# EAGLE design SparkFun_Digi_XBee_Explorer_USB-C (EAGLE 9.6.2)
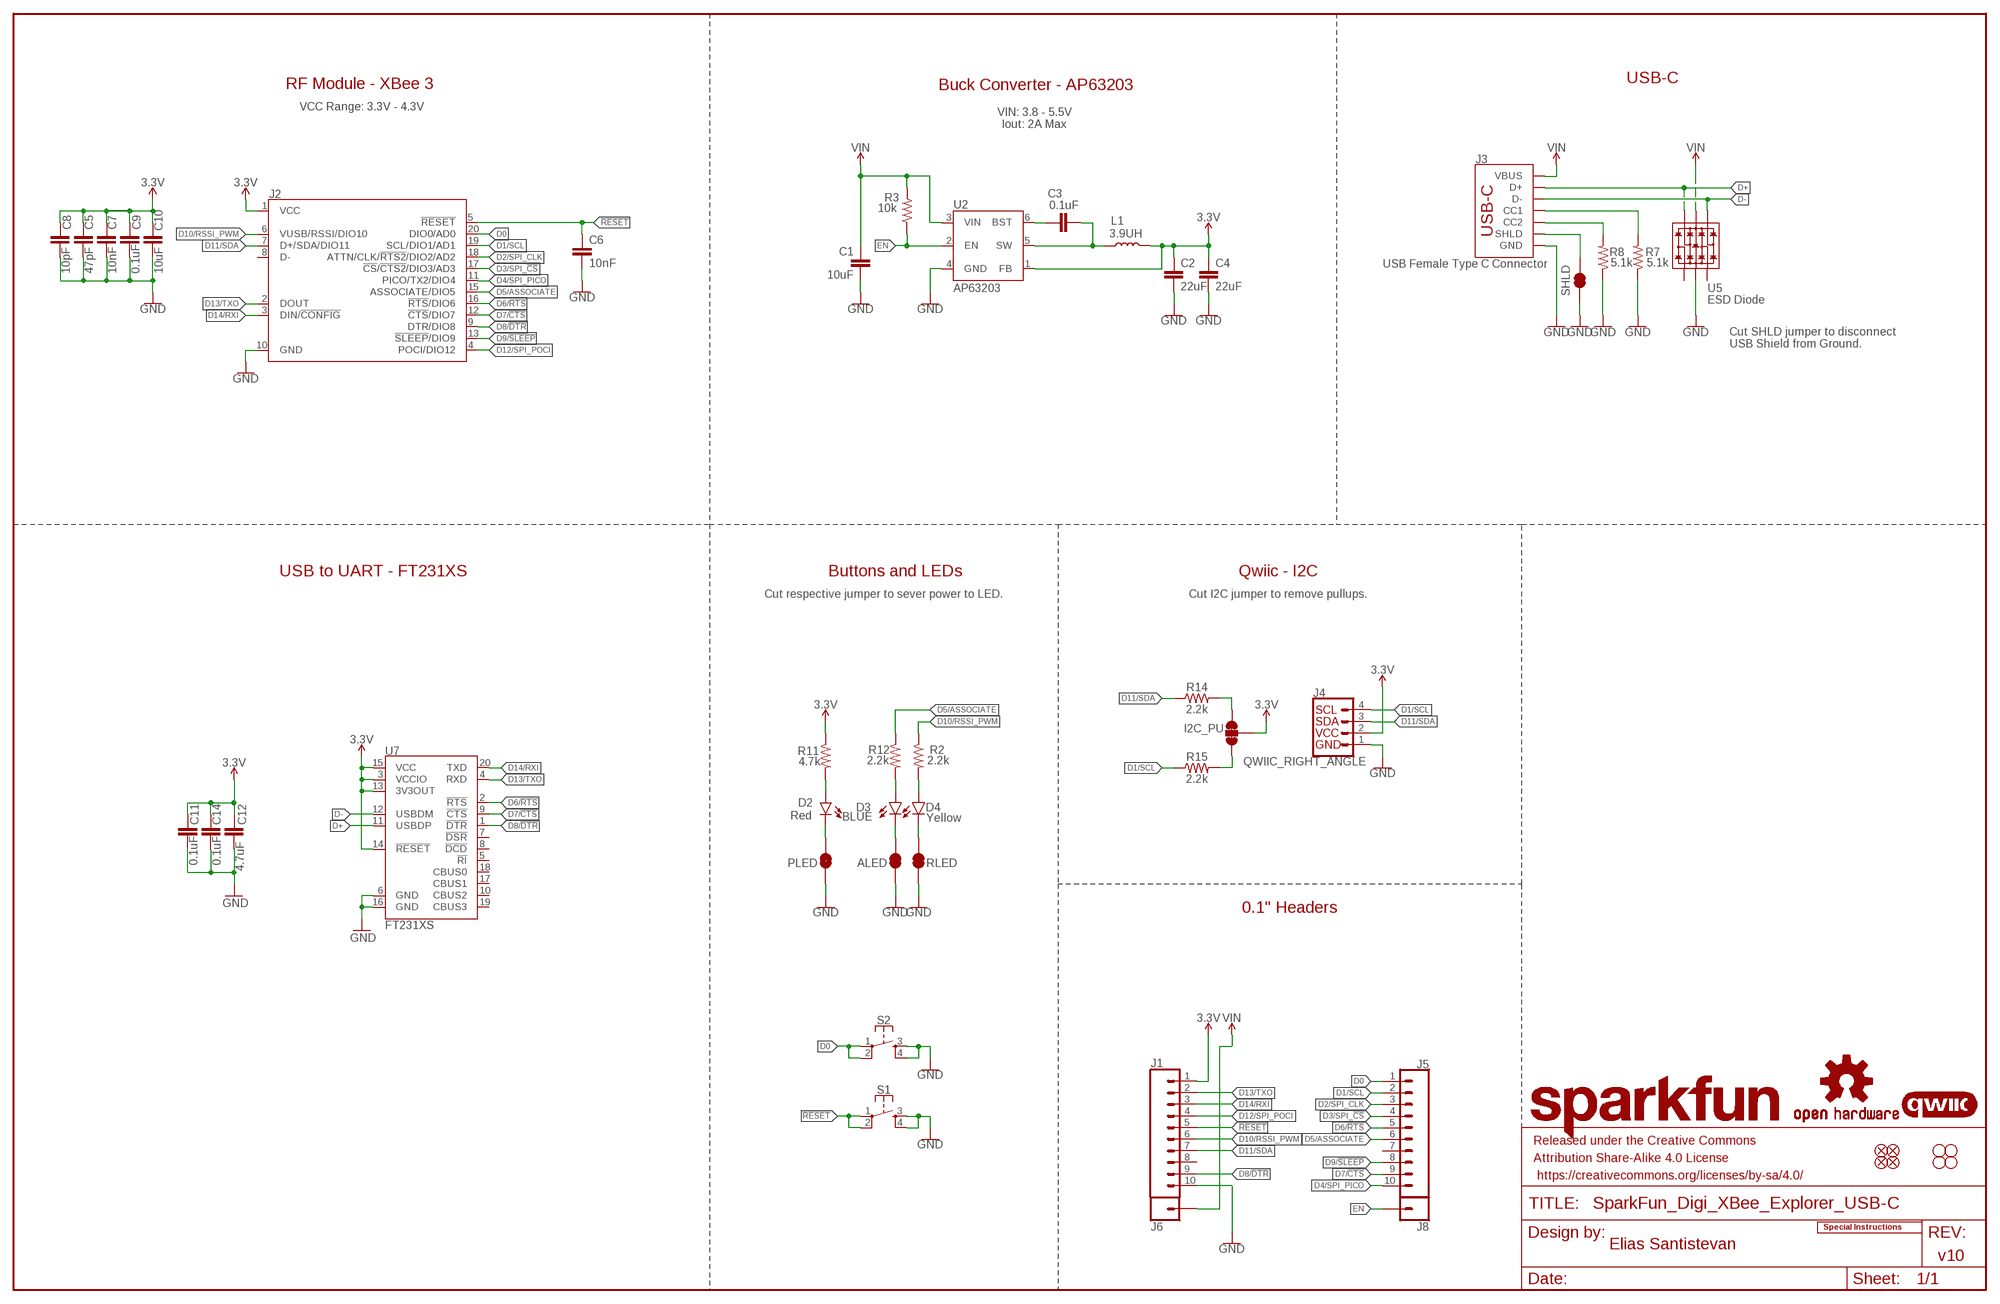
[diagram p0: schematic, sheet 1]

## Parts
ALED  JUMPER-SMT_2_NC_TRACE_SILK  [SMT-JUMPER_2_NC_TRACE_SILK]
C1  10uF  10UF-1210-50V-20%  [1210]
C2  22uF  22UF-0603-6.3V-20%  [0603]
C3  0.1uF  0.1UF-0603-25V-5%  [0603]
C4  22uF  22UF-0603-6.3V-20%  [0603]
C5  47pF  47PF-0603-50V-5%  [0603]
C6  10nF  10NF-0603-50V-10%  [0603]
C7  10nF  10NF-0603-50V-10%  [0603]
C8  10pF  10PF-0603-50V-5%  [0603]
C9  0.1uF  0.1UF-0603-25V-(+80/-20%)  [0603]
C10  10uF  10UF-0603-6.3V-20%  [0603]
C11  0.1uF  0.1UF-0603-25V-(+80/-20%)  [0603]
C12  4.7uF  4.7UF-0603-6.3V-(10%)  [0603]
C14  0.1uF  0.1UF-0603-25V-(+80/-20%)  [0603]
D2  Red  LED-RED_0603-KB  [LED-0603]
D3  BLUE  LED-BLUE0603  [LED-0603]
D4  Yellow  LED-YELLOW0603  [LED-0603]
FD1  FIDUCIAL1X2  [FIDUCIAL-1X2]
FD2  FIDUCIAL1X2  [FIDUCIAL-1X2]
FD3  FIDUCIAL1X2  [FIDUCIAL-1X2]
FD4  FIDUCIAL1X2  [FIDUCIAL-1X2]
FRAME1  FRAME-LEDGER  [CREATIVE_COMMONS]
H1  STAND-OFFTIGHT  [STAND-OFF-TIGHT]
H2  STAND-OFFTIGHT  [STAND-OFF-TIGHT]
H3  STAND-OFFTIGHT  [STAND-OFF-TIGHT]
H4  STAND-OFFTIGHT  [STAND-OFF-TIGHT]
I2C_PU  JUMPER-SMT_3_2-NC_TRACE_SILK  [SMT-JUMPER_3_2-NC_TRACE_SILK]
J1  CONN_01PTH_NO_SILK_STAND  [1X01_NO_SILK_STAND]
J2  XBEE_UPDATEXBEE_SMD  [XBEE3-SMD]
J3  USB Female Type C Connector  USB_C_4-LAYER-ISOLATED  [USB-C-16P-4LAYER-ISOLATED]
J4  QWIIC_RIGHT_ANGLE  QWIIC_CONNECTORJS-1MM  [JST04_1MM_RA]
J5  CONN_10NO_SILK_PTH_FEMALE  [1X10_NO_SILK]
J6  CONN_10NO_SILK_PTH_FEMALE  [1X10_NO_SILK]
J8  CONN_01PTH_NO_SILK_STAND  [1X01_NO_SILK_STAND]
L1  3.9UH  [INDUCTOR_3.9UH]
LOGO1  SFE_LOGO_NAME.2_INCH  [SFE_LOGO_NAME_.2]
LOGO2  OSHW-LOGOS  [OSHW-LOGO-S]
LOGO3  QWIIC_LOGO_4MM  [QWIIC_4MM]
LOGO4  SPECIAL_INSTRUCTIONS-ORDERING  [ORDERING_INSTRUCTIONS]
PLED  JUMPER-SMT_2_NC_TRACE_SILK  [SMT-JUMPER_2_NC_TRACE_SILK]
R2  2.2k  2.2KOHM-0603-1/10W-1%  [0603]
R3  10k  10KOHM-0603-1/10W-1%  [0603]
R7  5.1k  5.1KOHM5.1KOHM-0603-1/10W-1%  [0603]
R8  5.1k  5.1KOHM5.1KOHM-0603-1/10W-1%  [0603]
R11  4.7k  4.7KOHM-0603-1/10W-1%  [0603]
R12  2.2k  2.2KOHM-0603-1/10W-1%  [0603]
R14  2.2k  2.2KOHM-0603-1/10W-1%  [0603]
R15  2.2k  2.2KOHM-0603-1/10W-1%  [0603]
RLED  JUMPER-SMT_2_NC_TRACE_SILK  [SMT-JUMPER_2_NC_TRACE_SILK]
S1  MOMENTARY-SWITCH-SPST-2-SMD-5.2MM-TALL  [TACTILE_SWITCH_SMD_5.2MM]
S2  MOMENTARY-SWITCH-SPST-2-SMD-5.2MM-TALL  [TACTILE_SWITCH_SMD_5.2MM]
SHLD  JUMPER-SMT_2_NC_TRACE_SILK  [SMT-JUMPER_2_NC_TRACE_SILK]
U2  AP63203  [SOT23-6]
U5  ESD Diode  TVS_DIODE_ARRAY_DT1042-04SO-7  [SOT-23-6]
U7  FT231XS  [SSOP20_L]

## Nets
3.3V: C2.1 C4.1 C5.1 C7.1 C8.1 C9.1 C10.1 C11.1 C12.1 C14.1 I2C_PU.2 J2.1(VCC) J4.2 J6.1 L1.P$2 R11.1 U2.1(FB) U7.3(VCCIO) U7.13(3V3OUT) U7.14(!RESET) U7.15(VCC)
!RESET!: C6.1 J2.5(!RESET!) J6.5 S1.1 S1.2
D0: J2.20(DIO0/AD0) J5.1 S2.1 S2.2
D1/SCL: J2.19(SCL/DIO1/AD1) J4.4 J5.2 R15.1
D2/SPI_CLK: J2.18(ATTN/CLK/!RTS2!/DIO2/AD2) J5.3
D3/SPI_!CS!: J2.17(!CS!/!CTS2!/DIO3/AD3) J5.4
D4/SPI_PICO: J2.11(PICO/TX2/DIO4) J5.10
D5/ASSOCIATE: J2.15(ASSOCIATE/DIO5) J5.6 R12.1
D6/!RTS!: J2.16(!RTS!/DIO6) J5.5 U7.2(!RTS)
D7/!CTS!: J2.12(!CTS!/DIO7) J5.9 U7.9(!CTS)
D8/!DTR!: J2.9(DTR/DIO8) J6.9 U7.1(!DTR)
D9/!SLEEP!: J2.13(!SLEEP!/DIO9) J5.8
D10/RSSI_PWM: J2.6(VUSB/RSSI/DIO10) J6.6 R2.1
D11/SDA: J2.7(D+/SDA/DIO11) J4.3 J6.7 R14.1
D12/SPI_POCI: J2.4(POCI/DIO12) J6.4
D13/TXO: J2.2(DOUT) J6.2 U7.4(RXD)
D14/RXI: J2.3(DIN/!CONFIG!) J6.3 U7.20(TXD)
D+ [Diff pairs]: J3.A6(D+) J3.B6(D+) U5.6(IO4) U7.11(USBDP)
D- [Diff pairs]: J3.A7(D-) J3.B7(D-) U5.4(IO3) U7.12(USBDM)
EN: J8.1 R3.1 U2.2(EN)
GND: ALED.1 C1.2 C2.2 C4.2 C5.2 C6.2 C7.2 C8.2 C9.2 C10.2 C11.2 C12.2 C14.2 J2.10(GND) J3.GND J3.GND2(GND) J4.1 J6.10 PLED.1 R7.1 R8.1 RLED.1 S1.3 S1.4 S2.3 S2.4 SHLD.1 U2.4(GND) U5.2(VSS) U7.6(GND) U7.16(GND)
N$1: C3.1 U2.6(BST)
N$2: D4.A R2.2
N$3: D4.C RLED.2
N$5: J3.B5(CC2) R8.2
N$6: J3.A5(CC1) R7.2
N$7: D2.A R11.2
N$8: C3.2 L1.P$1 U2.5(SW)
N$11: I2C_PU.3 R14.2
N$12: D3.A R12.2
N$13: I2C_PU.1 R15.2
N$21: ALED.2 D3.C
N$23: D2.C PLED.2
SHLD: J3.SHLD1(SHLD) J3.SHLD2(SHLD) J3.SHLD3(SHLD) J3.SHLD4(SHLD) J3.SHLD5(SHLD) J3.SHLD6(SHLD) J3.SHLD7(SHLD) J3.SHLD8(SHLD) SHLD.2
VIN: C1.1 J1.1 J3.VBUS1(VBUS) J3.VBUS2(VBUS) R3.2 U2.3(VIN) U5.5(VCC)
Unconnected: J2.8(D-) J5.7 J6.8 U5.1(IO1) U5.3(IO2) U7.5(!RI) U7.7(!DSR) U7.8(!DCD) U7.10(CBUS2) U7.17(CBUS1) U7.18(CBUS0) U7.19(CBUS3)

## Notes on the sheet
- RF Module - XBee 3 | Buck Converter - AP63203 | USB-C
- VCC Range: 3.3V - 4.3V
- VIN: 3.8 - 5.5V
  Iout: 2A Max
- Cut SHLD jumper to disconnect
  USB Shield from Ground.
- USB to UART - FT231XS | Buttons and LEDs | Qwiic - I2C
- Cut respective jumper to sever power to LED. | Cut I2C jumper to remove pullups.
- 0.1" Headers
- Elias Santistevan
- v10

## Library data of the parts
ALED PLED RLED SHLD = SparkFun-Jumpers:JUMPER-SMT_2_NC_TRACE: Normally closed trace jumper This jumper has a trace between two pads so it's normally closed (NC). Use a razor knife to open the connection. For best results follow the IPC guidelines for cutting traces: Cutout at least 0.063 mm (0.005 in). Remove all loose material to clean up the cut area. Seal the cut with an approved epoxy. Reapply solder to reclose the connection.
C1 = SparkFun-Capacitors:10UF: 10.0µF ceramic capacitors A capacitor is a passive two-terminal electrical component used to store electrical energy temporarily in an electric field.; PROD_ID: CAP-09824
C2 C4 = SparkFun-Capacitors:22UF: 22µF ceramic capacitors A capacitor is a passive two-terminal electrical component used to store electrical energy temporarily in an electric field.; PROD_ID: CAP-14464
C3 = SparkFun-Capacitors:0.1UF: 0.1µF ceramic capacitors A capacitor is a passive two-terminal electrical component used to store electrical energy temporarily in an electric field.; PROD_ID: CAP-08604
C5 = SparkFun-Capacitors:47PF: 47pF ceramic capacitors A capacitor is a passive two-terminal electrical component used to store electrical energy temporarily in an electric field.; PROD_ID: CAP-08913
C6 C7 = SparkFun-Capacitors:10NF: 0.01uF/10nF/10,000pF ceramic capacitors A capacitor is a passive two-terminal electrical component used to store electrical energy temporarily in an electric field. CAP-09321; PROD_ID: CAP-00867
C8 = SparkFun-Capacitors:10PF: 10pF ceramic capacitors A capacitor is a passive two-terminal electrical component used to store electrical energy temporarily in an electric field.; PROD_ID: CAP-11812
C9 C11 C14 = SparkFun-Capacitors:0.1UF: 0.1µF ceramic capacitors A capacitor is a passive two-terminal electrical component used to store electrical energy temporarily in an electric field.; PROD_ID: CAP-00810
C10 = SparkFun-Capacitors:10UF: 10.0µF ceramic capacitors A capacitor is a passive two-terminal electrical component used to store electrical energy temporarily in an electric field.; PROD_ID: CAP-11015
C12 = SparkFun-Capacitors:4.7UF: 4.7µF ceramic capacitors A capacitor is a passive two-terminal electrical component used to store electrical energy temporarily in an electric field.; PROD_ID: CAP-08280
D2 = SparkFun-LED:LED-RED: Red SMD LED Used in manufacturing of most products at SparkFun Packages: 0603 - KB - KingBright (DIO-17976) SMD 0603 package [Datasheet] <https://www.kingbrightusa.com/images/catalog/SPEC/APT1608SURCK.pdf> 0603 - (DIO-00819, has gone EOL) SMD 0603 package 0603 SMART - SMD 0603 SMART package ( more efficient and expensive)[Product Link] <http://www.osram-os.com/Graphics/XPic2/00077099_0.pdf> 1206 - SMD1206 package [Product Link] <https://www.sparkfun.com/datasheets/DevTools/LilyPad/Q150OVS4.pdff> SparkFun Products: Pro Mini 328 -5V <https://www.sparkfun.com/products/821> RedBoard <https://www.sparkfun.com/products/12757> IOIO-OTG <https://www.sparkfun.com/products/13613>; PROD_ID: DIO-17976
D3 = SparkFun-LED:LED-BLUE: Blue SMD LED Used in manufacturing of various products at SparkFun Packages: 0603 - SMD 0603 package [Product Link] <http://www.digikey.com/product-detail/en/SMLE12BC7TT86/511-1589-2-ND/1641808> 1206 - SMD1206 package [Product Link] <http://www.digikey.com/product-detail/en/lite-on-inc/LTST-C150TBKT/160-1643-1-ND/573584> SparkFun Products: ESP8266 Thing-Dev Board <https://www.sparkfun.com/products/13711> RedBoard <https://www.sparkfun.com/products/12757>; PROD_ID: DIO-08575
D4 = SparkFun-LED:LED-YELLOW: Yellow SMD LED Used in manufacturing several products at SparkFun. Packages: 0603 - SMD 0603 package[Product Link] <http://www.kingbrightusa.com/product.asp?catalog_name=LED&product_id=APT1608SYCK> 0603 -SMART - SMART SMD 0603 package (more efficient/more expensive) [Product Link] <http://www.osram-os.com/osram_os/en/products/product-catalog/led-light-emitting-diodes/smartled-0603/ly-l29k/index.jsp> LilyPad - SMD1206 package[Product Datasheet] <https://www.sparkfun.com/datasheets/DevTools/LilyPad/Q150YUS4.pdf> SparkFun Products: Blynk Board <https://www.sparkfun.com/products/13794> IOIO-OTG <https://www.sparkfun.com/products/13613> XBee Explorer Serial <https://www.sparkfun.com/products/13225>; PROD_ID: DIO-09003
FD1-FD4 = SparkFun-Aesthetics:FIDUCIAL: Fiducial Alignment Points Point-of-reference for pick-and-place machines and other optical instruments.
FRAME1 = SparkFun-Aesthetics:FRAME-LEDGER: Schematic Frame - Ledger Standard 11x14 US Ledger frame
H1-H4 = SparkFun-Hardware:STAND-OFF: Stand Off Drill holes for mechanically mounting via screws, standoffs, etc. Note: Use the keepout ring to avoid running the screw head into surrounding components. Variant Overviews STAND-OFF - Mechanical footprint for a #4 phillips button head screw. STAND-OFF-TIGHT - Mechanical footprint for a #4 phillips button head screw, Example SparkFun Products Screw - Phillips Head (1/4", 4-40, 10 pack) <https://www.sparkfun.com/products/10453> (PRT-10453) Screw - Phillips Head (1/2", 4-40, 10 pack) <https://www.sparkfun.com/products/10452> (PRT-10452) Screw - Phillips Head (3/4", 4-40, 10 pack) <https://www.sparkfun.com/products/10451> (PRT-10451) Screw - Phillips Head (1", 4-40, 10 pack) <https://www.sparkfun.com/products/10450> (PRT-10450)
I2C_PU = SparkFun-Jumpers:JUMPER-SMT_3_2-NC_TRACE: Normally closed trace jumper (2 of 2 connections) This jumper has a trace between all three pads so they are normally closed (NC). Use a razor knife to open the connection(s). For best results follow the IPC guidelines for cutting traces: Cutout at least 0.063 mm (0.005 in). Remove all loose material to clean up the cut area. Seal the cut with an approved epoxy. Reapply solder to reclose the connection(s).
J1 J8 = SparkFun-Connectors:CONN_01: Single connection point. Often used as Generic Header-pin footprint for 0.1 inch spaced/style header connections On any of the 0.1 inch spaced packages, you can populate with these: Break Away Headers - Straight <https://www.sparkfun.com/products/116> (PRT-00116) Break Away Male Headers - Right Angle <https://www.sparkfun.com/products/553> (PRT-00553) Female Headers <https://www.sparkfun.com/products/115> (PRT-00115) Break Away Headers - Machine Pin <https://www.sparkfun.com/products/117> (PRT-00117) Break Away Female Headers - Swiss Machine Pin <https://www.sparkfun.com/products/743> (PRT-00743) This device is also useful as a general connection point to wire up your design to another part of your project. Our various solder wires solder well into these plated through hole pads. Hook-Up Wire - Assortment (Stranded, 22 AWG) <https://www.sparkfun.com/products/11375> (PRT-11375) Hook-Up Wire - Assortment (Solid Core, 22 AWG) <https://www.sparkfun.com/products/11367> (PRT-11367) View the entire wire category on our website here <https://www.sparkfun.com/categories/141> Special notes: SMTSO-256-ET is a "flush mount" nut for a 4-40 screw. We mostly use this on specialty testbeds; it is a nice way to connect hardware to your PCB at an adjustable hieght. Also note, the SNAP packages are for using a snappable style connector. We sell a baggie of snaps and they are also used on two LilyPad designs: Snap Assortment - 30 pack (male and female) <https://www.sparkfun.com/products/11347> (DEV-11347) LilyPad Arduino SimpleSnap <https://www.sparkfun.com/products/10941> (DEV-10941) LilyPad SimpleSnap Protoboard <https://www.sparkfun.com/products/10940> (DEV-10940)
J2 = xbee_smart_modem:XBEE_UPDATE: XBee 3 Cat 1 Smart Modem
J3 = SparkFun-Connectors:USB_C: USB Type C 16Pin Connector Super Speed pins not available on the 16-pin purely SMD connector so this part is best for USB 2.0 implementations. D1 and D2 are tied together enabling D+/- no matter which way the cable is plugged into the connector. The two channel configuration pins (CC1/2) are exposed. These are normally connected to ground via 5.1k resistors but can be reconfigured for high current/high power applications. **4-LAYER BOARD WARNING!!** If designing 4-layer board, make sure to select the variant _4-LAYER-ISOLATED. The linked footprint (USB-C-16-4LAYER-ISOLATED) includes some very necessary cutout polygons in the inner layers (2 and 15). This prevents the PTH mounting shield legs on the USB connector from electrically connecting any other polygons on the inner layers (usually VCC and GND).; PROD_ID: CONN-14122
J4 = SparkFun-Connectors:QWIIC_CONNECTOR: SparkFun I2C Standard Qwiic Connector An SMD 1mm pitch JST connector makes it easy and quick (get it? Qwiic?) to connect I2C devices to each other. The Qwiic system <http://www.sparkfun.com/qwiic> enables fast and solderless connection between popular platforms and various sensors and actuators. We carry 200mm <https://www.sparkfun.com/products/14204>, 100mm <https://www.sparkfun.com/products/14205>, 50mm <https://www.sparkfun.com/products/14206>, and breadboard friendly <https://www.sparkfun.com/products/14207> Qwiic cables. We also offer 10 pcs strips <https://www.sparkfun.com/products/14323> the SMD connectors.; PROD_ID: CONN-13694
J5 J6 = SparkFun-Connectors:CONN_10: Multi connection point. Often used as Generic Header-pin footprint for 0.1 inch spaced/style header connections On any of the 0.1 inch spaced packages, you can populate with these: Break Away Headers - Straight <https://www.sparkfun.com/products/116> (PRT-00116) Break Away Male Headers - Right Angle <https://www.sparkfun.com/products/553> (PRT-00553) Female Headers <https://www.sparkfun.com/products/115> (PRT-00115) Break Away Headers - Machine Pin <https://www.sparkfun.com/products/117> (PRT-00117) Break Away Female Headers - Swiss Machine Pin <https://www.sparkfun.com/products/743> (PRT-00743) Arduino Stackable Header - 10 Pin <https://www.sparkfun.com/products/11376> (PRT-11376) For SCREWTERMINALS and SPRING TERMINALS visit here: Screw Terimnals on SparkFun.com <https://www.sparkfun.com/search/results?term=Screw+Terminals> (5mm/3.5mm/2.54mm spacing) This device is also useful as a general connection point to wire up your design to another part of your project. Our various solder wires solder well into these plated through hole pads. Hook-Up Wire - Assortment (Stranded, 22 AWG) <https://www.sparkfun.com/products/11375> (PRT-11375) Hook-Up Wire - Assortment (Solid Core, 22 AWG) <https://www.sparkfun.com/products/11367> (PRT-11367) View the entire wire category on our website here <https://www.sparkfun.com/categories/141> Special notes: Molex polarized connector foot print use with SKU : PRT-08231 with associated crimp pins and housings. 1MM SMD Version SKU: PRT-10208 NOTES ON THE VARIANTS LOCK and LOCK_LONGPADS... This footprint was designed to help hold the alignment of a through-hole component (i.e. 6-pin header) while soldering it into place. You may notice that each hole has been shifted either up or down by 0.005 of an inch from it's more standard position (which is a perfectly straight line). This slight alteration caused the pins (the squares in the middle) to touch the edges of the holes. Because they are alternating, it causes a "brace" to hold the component in place. 0.005 has proven to be the perfect amount of "off-center" position when using our standard breakaway headers. Although looks a little odd when you look at the bare footprint, once you have a header in there, the alteration is very hard to notice. Also,if you push a header all the way into place, it is covered up entirely on the bottom side.
L1 = SparkFun-Coils:3.9UH: Würth's Electronik 3.9uH Inductor Characteristics 3.9uH 2.4A Current Rating 2.8A Saturation Inductance Frequency: 100kHzd AEC-Q200 Certified 5mm x 5mm Package 30% tolerance; PROD_ID: NDUC-18014
LOGO1 = SparkFun-Aesthetics:SFE_LOGO_NAME: SparkFun Font Logo This is the SparkFun name logo. The logo on the schematic will always be the same size; the package variant is the height of the flame part of the logo (or the height the flame would be, if it were drawn). Default layer for the logo on the board is tSilk.
LOGO2 = SparkFun-Aesthetics:OSHW-LOGO: Open-Source Hardware (OSHW) Logo This logo indicates the piece of hardware it is found on incorporates a OSHW license and/or adheres to the definition of open source hardware found here: http://freedomdefined.org/OSHW
LOGO3 = SparkFun-Aesthetics:QWIIC_LOGO: Qwiic Logos for placement on schematic and PCB. The 5.5mm silk logo is best for placing next to Qwiic connector.
LOGO4 = SparkFun-Aesthetics:SPECIAL_INSTRUCTIONS: Special Ordering/Production Instructions Alert Symbol for special PCB ordering instructions or unique production process warnings. Ordering Instructions Production Instructions Types of information that should be added to box: Copper weight Soldermask color Silk color PCB thickness Number of layers PCB Standard: 1.6mm FR4 1 oz copper immersion silver plating red soldermask white silkscreen Types of information that should be added to box: Special wash requirements Depaneling instructions Humidification Glue curing Default text settings: 0.07 inch 9% ratio 50% line distance
R2 R12 R14 R15 = SparkFun-Resistors:2.2KOHM: 2.2kΩ resistor A resistor is a passive two-terminal electrical component that implements electrical resistance as a circuit element. Resistors act to reduce current flow, and, at the same time, act to lower voltage levels within circuits. - Wikipedia; PROD_ID: RES-08272
R3 = SparkFun-Resistors:10KOHM: 10kΩ resistor A resistor is a passive two-terminal electrical component that implements electrical resistance as a circuit element. Resistors act to reduce current flow, and, at the same time, act to lower voltage levels within circuits. - Wikipedia; PROD_ID: RES-00824
R7 R8 = SparkFun-Resistors:5.1KOHM; PROD_ID: RES-12083
R11 = SparkFun-Resistors:4.7KOHM: 4.7kΩ resistor A resistor is a passive two-terminal electrical component that implements electrical resistance as a circuit element. Resistors act to reduce current flow, and, at the same time, act to lower voltage levels within circuits. - Wikipedia; PROD_ID: RES-07857
S1 S2 = SparkFun-Switches:MOMENTARY-SWITCH-SPST-2: Momentary Switch (Pushbutton) - SPST - Two Circuits Normally-open (NO) SPST momentary switches (buttons, pushbuttons). Schematic symbol includes two switch circuits. Variants SMD-4.6MMX2.8MM - 4.60mm x 2.80mm Tactile Momentary Button Switch - Used on SparkFun Pro Micro - RP2040 <https://www.sparkfun.com/products/17717> SMD-5.2MM - Mini Pushbutton Switch - SMD <https://www.sparkfun.com/products/8720> - Used on Arduino Pro Mini <https://www.sparkfun.com/products/11114>; PROD_ID: SWCH-14139
U2 = SparkFun-IC-Power:AP63203: Diodes Inc. AP63203 3.8V-32V input 3.3V Buck The AP63200/AP63201/AP63203/AP63205 is a 2A, synchronous buck converter with a wide input voltage range of 3.8V to 32V and fully integrates a 125mΩ high-side power MOSFET and a 68mΩ lowside power MOSFET to provide high-efficiency step-down DC/DC conversion; PROD_ID: VREG-15244
U5 = SparkFun-DiscreteSemi:TVS_DIODE_ARRAY; PROD_ID: IC-13538
U7 = SparkFun-IC-Comms:FT231X: FTDI FT231X Full Speed USB to Full-handshake UART This USB2.0 Full Speed IC offers a compact bridge to full handshake UART interfaces. The device is a UART, capable of operating up to 3MBaud, with low power consumption (8mA). The FT231X includes the complete FT-X series feature set and enables USB to be added into a system design quickly and easily over a UART interface. Datasheet <http://cdn.sparkfun.com/datasheets/Components/General%20IC/DS_FT231X.pdf> SparkFun Products SparkFun RedBoard - Programmed with Arduino <https://www.sparkfun.com/products/12757> (DEV-12757) SparkFun XBee Explorer USB <https://www.sparkfun.com/products/11812> (WRL-11812) SparkFun XBee Explorer Dongle <https://www.sparkfun.com/products/11697> (WRL-11697) SparkFun Blynk Board - ESP8266 <https://www.sparkfun.com/products/13794> (WRL-13794) SparkFun ESP8266 Thing - Dev Board <https://www.sparkfun.com/products/13711> (WRL-13711) SparkFun Block for Intel® Edison - Base <https://www.sparkfun.com/products/13045> (DEV-13045) SparkFun RedStick <https://www.sparkfun.com/products/13741> (DEV-13741) SparkFun Beefy 3 - FTDI Basic Breakout <https://www.sparkfun.com/products/13746> (DEV-13746) SparkFun FT231X Breakout <https://www.sparkfun.com/products/11736> (BOB-11736); PROD_ID: IC-11524

## Net classes
1 POWER: width 0.559 mm, drill 0.305 mm
2 Diff pairs: width 0.203 mm, drill 0.305 mm, clearance 0.152 mm

## Board
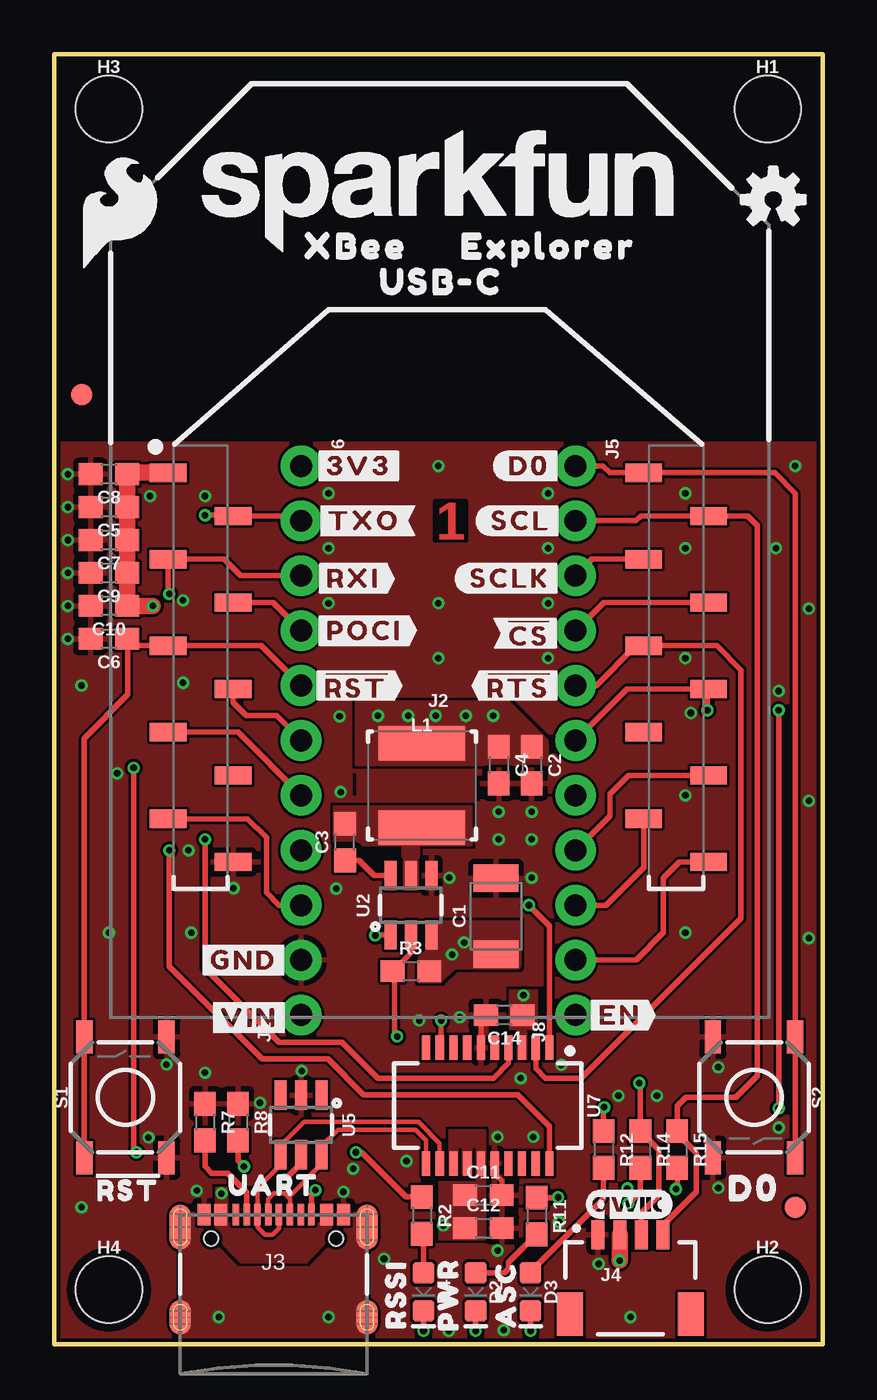
[diagram p1: board, top side]
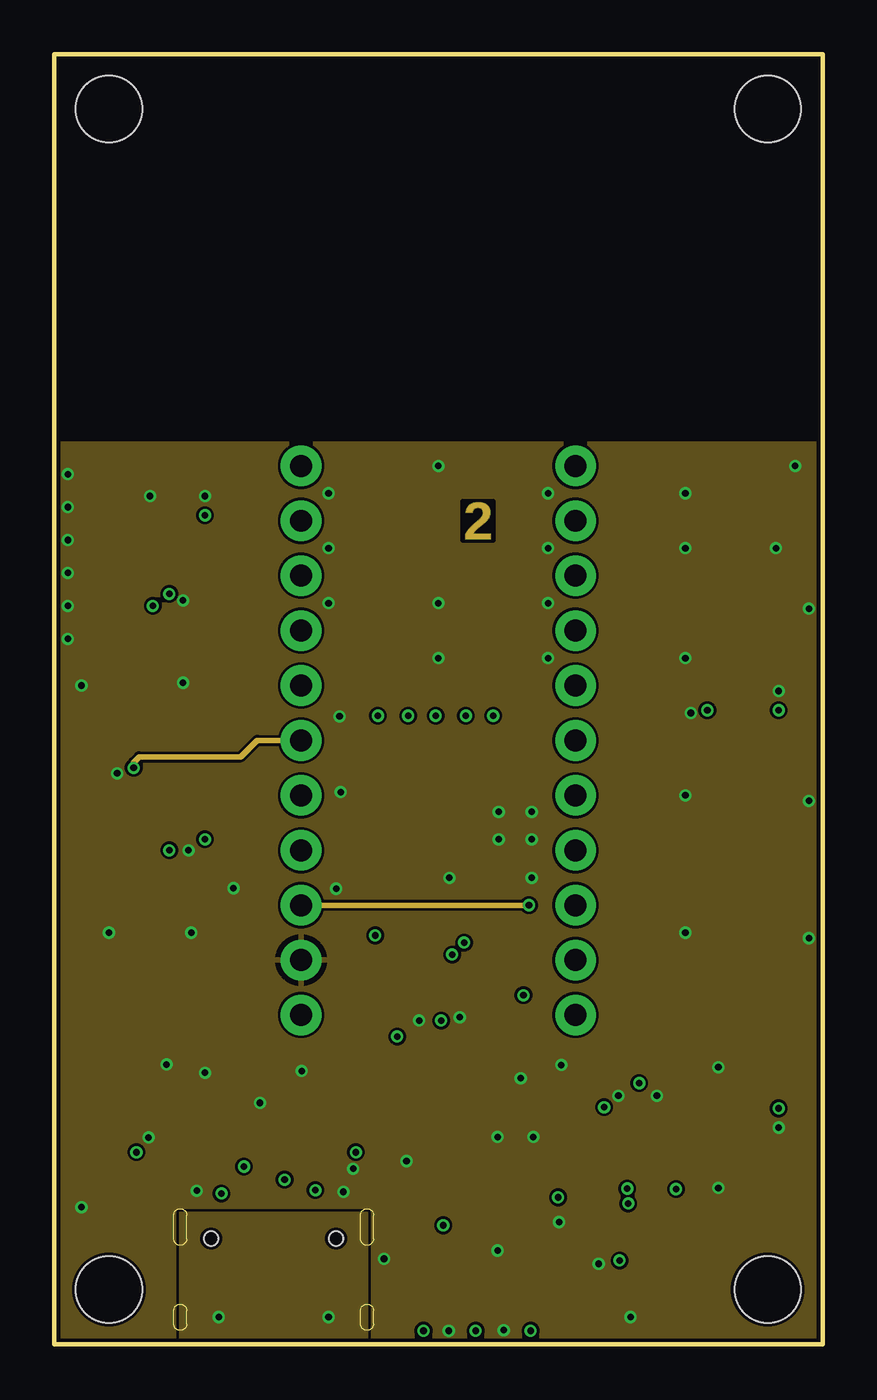
[diagram p2: board, inner layer Route2]
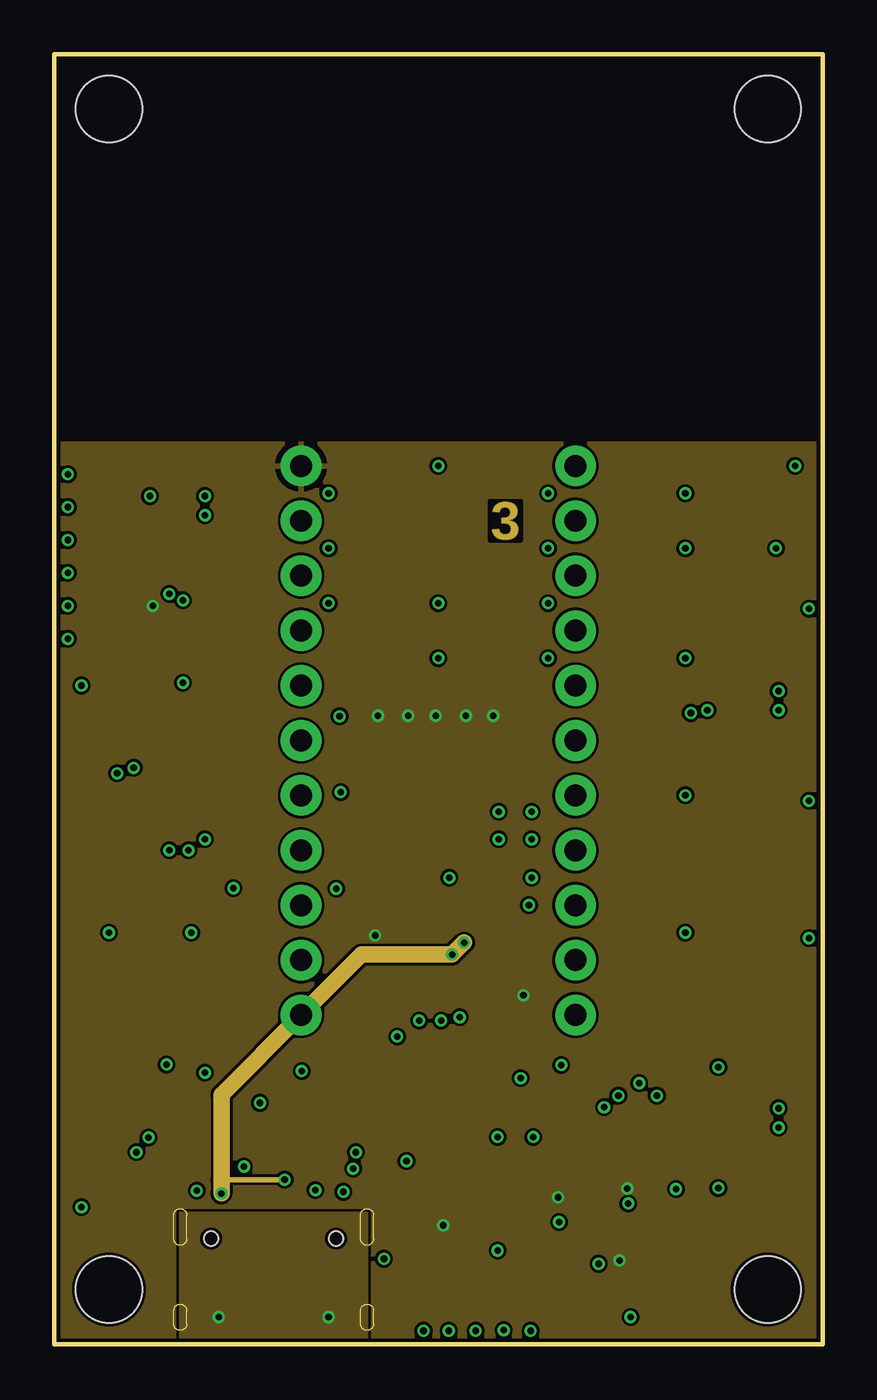
[diagram p3: board, inner layer Route15]
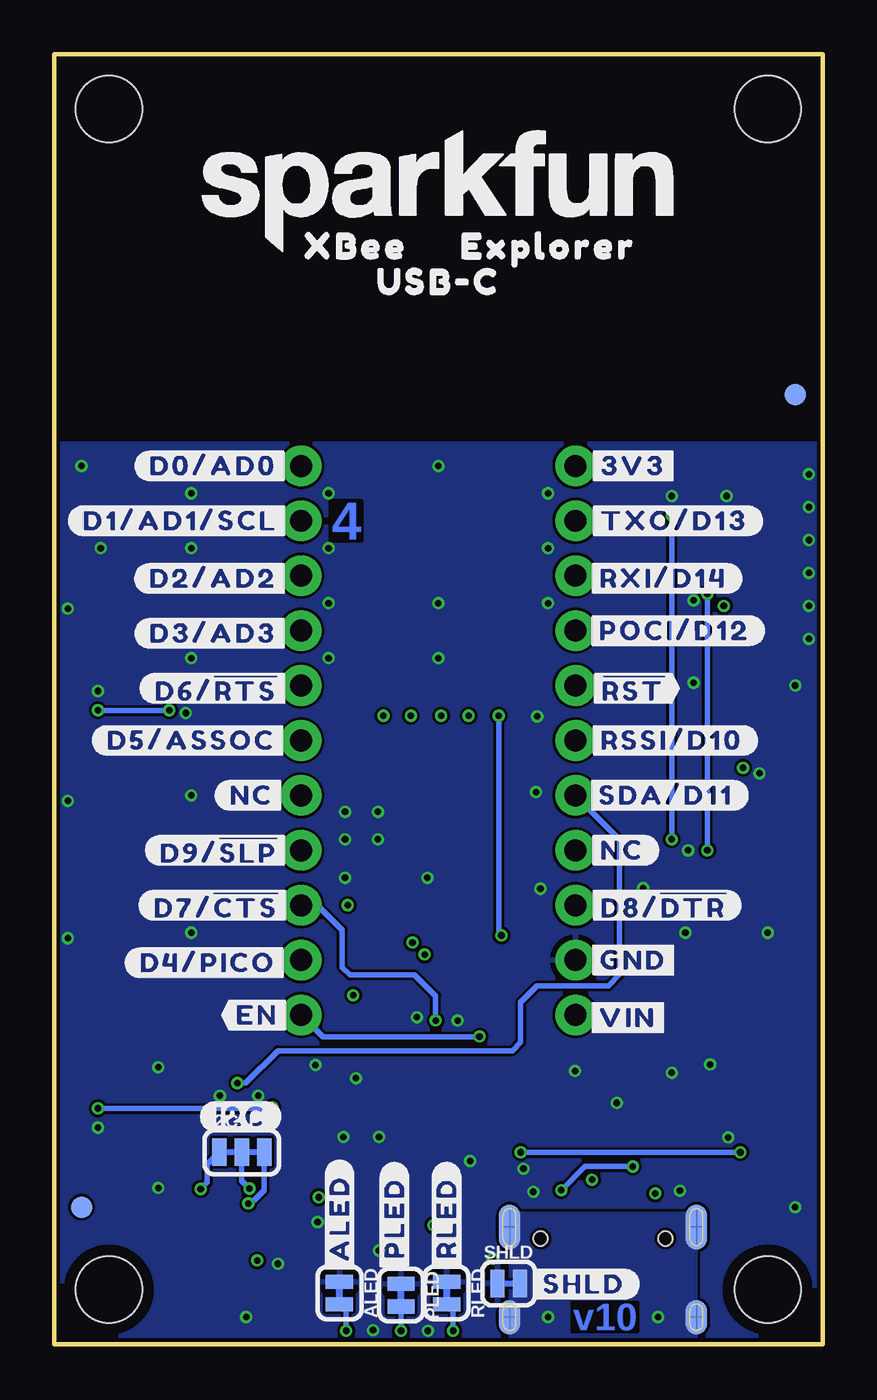
[diagram p4: board, bottom side, seen from below]

Size 35.56 x 59.69 mm. Coordinates in mm from the lower left corner, seen from the top.
Outline: 0,59.69 0,0 35.56,0 35.56,59.69 0,59.69
Copper layers (1*2*15*16): Top 0.035559375mm / dielectric 0.47751875mm / Route2 0.035559375mm / dielectric 0.47751875mm / Route15 0.035559375mm / dielectric 0.47751875mm / Bottom 0.035559375mm
Design rules "SparkFun-4-Layer-Minimum-JLCPCB": minimum track width 5mil, minimum drill 0.2mm, track to track 5mil, track to pad 5mil, pad to pad 5mil, via to via 5mil, smd to smd 5mil, copper to edge 7mil, drill to drill 7mil, minimum pad ring 5mil, minimum via ring 5mil, stop-mask expansion 2.5mil, vias tented up to drill 25mil, thermal gap 10mil
tRestrict: area 13.8,25.4 to 14,26.4; area 19.6,25.1 to 19.7,26.3

### Footprints (pad centres in the part's own frame; a part is rotated, then mirrored left to right if it is on the bottom)
SMT-JUMPER_2_NC_TRACE_SILK = smd 0.66 x 1.27: 1 -0.521,0; 2 0.521,0
1210 = smd 1.27 x 2.06: 1 -1.755,0; 2 1.755,0
0603 = smd 1.1 x 1: 1 -0.85,0; 2 0.85,0
LED-0603 = smd 1 x 1: A -0.877,0; C 0.877,0
FIDUCIAL-1X2 = smd 1 x 1: 1 0,0
STAND-OFF-TIGHT = hole 3.048: 0,0
SMT-JUMPER_3_2-NC_TRACE_SILK = smd 0.66 x 1.27: 1 -1.041,0; 2 0,0; 3 1.041,0
1X01_NO_SILK_STAND = drill 1.016 pad 1.88: 1 0,0
XBEE3-SMD = smd 1.7 x 0.85: 1 -12.5,11.11; 2 -9.5,9.11; 3 -12.5,7.11; 4 -9.5,5.11; 5 -12.5,3.11; 6 -9.5,1.11; 7 -12.5,-0.89; 8 -9.5,-2.89; 9 -12.5,-4.89; 10 -9.5,-6.89; 11 12.5,-6.89; 12 9.5,-4.89; 13 12.5,-2.89; 14 9.5,-0.89; 15 12.5,1.11; 16 9.5,3.11; 17 12.5,5.11; 18 9.5,7.11; 19 12.5,9.11; 20 9.5,11.11
USB-C-16P-4LAYER-ISOLATED = smd 0.3 x 1: A5 -1.25,-0.34; A6 -0.25,-0.34; A7 0.25,-0.34; A8 1.25,-0.34; B5 1.75,-0.34; B6 0.75,-0.34; B7 -0.75,-0.34; B8 -1.75,-0.34 | smd 0.6 x 1: GND -3.225,-0.34; GND2 3.225,-0.34; VBUS1 -2.45,-0.34; VBUS2 2.45,-0.34 | smd 1 x 2.1: SHLD1 -4.32,-0.915; SHLD2 4.32,-0.915 | smd 1 x 2.1 bottom: SHLD3 -4.32,-0.915; SHLD4 4.32,-0.915 | smd 1 x 1.6: SHLD5 -4.32,-5.095; SHLD8 4.32,-5.095 | smd 1 x 1.6 bottom: SHLD6 -4.32,-5.095; SHLD7 4.32,-5.095 | hole 0.65: -2.89,-1.445; 2.89,-1.445
JST04_1MM_RA = smd 0.6 x 1.35: 1 -1.5,0; 2 -0.5,0; 3 0.5,0; 4 1.5,0 | smd 1.2 x 2: NC1 2.8,-3.675; NC2 -2.8,-3.675
1X10_NO_SILK = drill 1.016 pad 1.88: 1 0,0; 2 2.54,0; 3 5.08,0; 4 7.62,0; 5 10.16,0; 6 12.7,0; 7 15.24,0; 8 17.78,0; 9 20.32,0; 10 22.86,0
INDUCTOR_3.9UH = smd 4 x 1.6: P$1 0,-2; P$2 0,1.9
TACTILE_SWITCH_SMD_5.2MM = smd 1.524 x 0.762: 1 -2.794,1.905; 2 2.794,1.905; 3 -2.794,-1.905; 4 2.794,-1.905
SOT23-6 = smd 0.55 x 1.35: 1 -0.95,-1.375; 2 0,-1.375; 3 0.95,-1.375; 4 0.95,1.375; 5 0,1.375; 6 -0.95,1.375
SOT-23-6 = smd 0.55 x 1.35: 1 -0.95,-1.375; 2 0,-1.375; 3 0.95,-1.375; 4 0.95,1.375; 5 0,1.375; 6 -0.95,1.375
SSOP20_L = smd 0.381 x 1.143: 1 -2.857,-2.68; 2 -2.223,-2.68; 3 -1.587,-2.68; 4 -0.953,-2.68; 5 -0.318,-2.68; 6 0.318,-2.68; 7 0.953,-2.68; 8 1.587,-2.68; 9 2.223,-2.68; 10 2.857,-2.68; 11 2.857,2.68; 12 2.223,2.68; 13 1.587,2.68; 14 0.953,2.68; 15 0.318,2.68; 16 -0.318,2.68; 17 -0.953,2.68; 18 -1.587,2.68; 19 -2.223,2.68; 20 -2.857,2.68

### Placement (x,y rotation side)
ALED  22.35,2.38 270 bottom
C1  20.45,19.81 90 top
C2  22.1,26.8 270 top
C3  13.46,23.24 90 top
C4  20.57,26.8 270 top
C5  2.54,38.73 180 top
C6  2.54,32.64 180 top
C7  2.54,37.21 180 top
C8  2.54,40.26 180 top
C9  2.54,35.69 180 top
C10  2.54,34.16 180 top
C11  19.86,6.91 0 top
C12  19.86,5.38 0 top
C14  20.83,15.24 180 top
D2  19.51,2.44 270 top
D3  22.05,2.44 270 top
D4  17.09,2.44 270 top
FD1  1.27,43.94 0 top
FD2  1.27,43.94 0 bottom
FD3  34.29,6.35 0 top
FD4  34.29,6.35 0 bottom
FRAME1  -10.16,-26.67 0 top  (outside the outline)
H1  33.02,57.15 0 top
H2  33.02,2.54 0 top
H3  2.54,57.15 0 top
H4  2.54,2.54 0 top
I2C_PU  26.87,8.89 0 bottom
J1  11.43,15.24 90 top
J2  17.78,29.21 0 top
J3  10.16,6.35 0 top
J4  26.67,5.08 0 top
J5  24.13,40.64 270 top
J6  11.43,40.64 270 top
J8  24.13,15.24 90 top
L1  17.02,25.91 0 top
LOGO1  17.78,53.34 0 top
LOGO2  33.27,52.96 0 top
LOGO3  26.62,6.48 0 top
LOGO4  44.45,59.69 0 top  (outside the outline)
PLED  19.51,2.28 270 bottom
R2  17.02,5.97 270 top
R3  16.51,17.27 0 top
R7  6.99,10.29 270 top
R8  8.51,10.29 270 top
R11  22.33,5.94 270 top
R12  25.43,9.02 270 top
R14  27.13,9.02 270 top
R15  28.83,9.02 270 top
RLED  17.4,2.38 270 bottom
S1  3.3,11.43 90 top
S2  32.38,11.43 270 top
SHLD  14.53,2.82 0 bottom
U2  16.51,20.32 0 top
U5  11.43,10.16 180 top
U7  20.07,11.05 180 top
U$1  [RSSI31]  15.82,2.31 90 top
U$2  [PWR29]  18.24,2.31 90 top
U$3  [#GND#0]  8.76,17.78 0 top
U$4  [#SHLD#36]  11.05,2.79 0 bottom
U$5  [#NC#1]  9.27,22.86 0 bottom
U$6  [#D3#AD3#23]  28.19,32.89 0 bottom
U$7  [#NC#3]  26.42,25.4 0 bottom
U$8  [#D0#AD0#18]  28.19,40.64 0 bottom
U$9  [#3V3#1]  14.1,40.64 0 top
U$10  [XBEE340]  13.97,50.8 0 top
U$11  [#D1#AD1#SCL#8]  29.72,38.1 0 bottom
U$12  [#GND#0]  8.76,17.78 0 bottom
U$13  [#D8##DTR##27]  7.37,20.32 0 bottom
U$14  [#RSSI#D10#17]  6.99,27.94 0 bottom
U$15  [#SDA#D11#9]  7.24,25.4 0 bottom
U$16  [##RST##15]  8.76,30.35 0 bottom
U$17  [#POCI#D12#24]  6.86,33.02 0 bottom
U$18  [#RXI#D14#15]  7.37,35.43 0 bottom
U$19  [#D2#AD2#19]  28.19,35.43 0 bottom
U$20  [#D6##RTS##25]  28.07,30.35 0 bottom
U$21  [#TXO#8]  14.35,38.1 0 top
U$22  [#TXO#D13#13]  6.86,38.1 0 bottom
U$23  [XBEE340]  21.59,50.8 0 bottom
U$24  [USB#C1342]  17.91,49.15 0 top
U$25  [USB#C1342]  17.78,49.15 0 bottom
U$26  [#I2C#33]  26.92,10.54 0 bottom
U$27  [#RXI#7]  13.84,35.43 0 top
U$28  [UART34]  10.16,7.37 0 top
U$29  [ASC32]  20.9,2.31 90 top
U$30  [#RST#30]  3.43,7.25 0 top
U$31  [EXPLORER1344]  22.86,50.8 0 top
U$32  [EXPLORER1344]  12.7,50.8 0 bottom
U$35  [#D5#ASSOC#25]  29.21,27.94 0 bottom
U$36  [#D9##SLP##28]  27.94,22.86 0 bottom
U$37  [#D7##CTS##26]  28.07,20.32 0 bottom
U$38  [#D4#PICO#25]  28.45,17.65 0 bottom
U$40  [D03]  32.38,7.23 0 top
U$44  [#3V3#1]  8.76,40.64 0 bottom
U$45  [#POCI#32]  14.35,33.02 0 top
U$46  [#VIN#4]  9.02,15.11 0 bottom
U$48  [#EN#17]  26.16,15.24 0 top
U$49  [#ALED#21]  22.35,5.84 90 bottom
U$51  [#RLED#22]  17.4,5.84 90 bottom
U$52  [#PLED#20]  19.81,5.84 90 bottom
U$54  [##RST##13]  13.97,30.48 0 top
U$58  [##RTS##14]  21.46,30.48 0 top
U$59  [##CS##26]  21.97,32.89 0 top
U$60  [#SCLK#33]  21.08,35.43 0 top
U$61  [SFE_LOGO_FLAME_.2]  3.05,52.32 0 top
U$63  [SFE_LOGO_NAME_.2]  17.78,53.34 0 bottom
U$64  [#SCL#9]  21.59,38.1 0 top
U$65  [#D0#3]  21.97,40.64 0 top
U$66  [#VIN#4]  9.02,15.11 0 top
U$67  [#EN#15]  26.16,15.24 0 bottom

### Tracks (layer width: path | path; a pad name or v marks a point on that pad's centre or on a via)
3.3V  (via drill 0.3)
  Top 0.254: U2.1 14.86,18.95 v14.86,18.92 | v23.32,6.81 23.3,6.79 R11.1
  Top 0.762: J2.1 3.45,40.32 C8.1 C5.1 C7.1 C9.1 C10.1 v4.57,34.16 | J4.2 v26.17,3.89 v26.16,3.89
  Bottom 0.254: v14.86,18.92 14.99,19.05 v14.99,29.08 | I2C_PU.2 26.87,7.57 v26.52,7.21
  other vias: 17.65,29.08 16.38,29.08 19.05,29.08 18.01,5.51 21.72,16.15 20.32,29.08
  pour Route15 (isolate 0.127, rank 3): 0,0 35.56,0 35.56,41.66 0,41.66
  pour Top (isolate 0.305, no thermals): 13.97,26.8 22.86,26.8 22.86,27.94 21.06,29.74 13.97,29.74
  pour Top (no thermals): 17.83,7.49 17.83,4.88 19.94,4.88 19.94,9.91 18.29,9.91 18.29,7.87 18.67,7.87 18.67,9.14 18.92,9.14 18.92,7.87 19.3,7.87 19.3,9.14 19.56,9.14 19.56,7.49
  pour Top (no thermals): 21.84,13.21 21.84,14.61 22.35,14.61 22.35,16.38 21.08,16.38 21.08,14.61 21.46,14.61 21.46,13.21
!RESET!
  Top 0.254: J6.5 9.59,32.32 J2.5 3.71,32.32 3.41,32.62 | 3.41,32.62 C6.1 | S1.1 S1.2 1.4,28.04 3.41,30.05 3.41,32.62
D0
  Top 0.254: J5.1 25.4,40.64 25.72,40.32 J2.20 33.34,40.32 34.29,39.37 S2.1 S2.2
D1/SCL
  Top 0.254: J5.2 26.92,38.1 27.14,38.32 J2.19 32.09,38.32 32.54,37.87 32.54,12.42 31.55,11.43 29.22,11.43 28.83,11.04 R15.1 28.83,9.75 29.72,8.87 29.72,7.06 28.17,5.51 J4.4
D2/SPI_CLK
  Top 0.254: J2.18 24.89,36.32 J5.3
D3/SPI_!CS!
  Top 0.254: J5.4 25.43,34.32 J2.17
D4/SPI_PICO
  Top 0.254: J5.10 24.14,17.79 26.94,17.79 28.19,19.05 28.19,21.59 28.92,22.32 J2.11
D5/ASSOCIATE  (via drill 0.3)
  Top 0.254: J5.6 26.51,30.32 J2.15 30.23,30.27 v30.23,29.34 | v25.45,10.97 25.43,10.95 R12.1 | v33.53,29.34 v33.53,10.92
  Bottom 0.254: v33.53,29.34 v30.23,29.34 | v33.53,10.92 25.5,10.92 v25.45,10.97
D6/!RTS!
  Top 0.254: J5.5 25.08,30.48 26.92,32.32 J2.16 30.66,32.32 31.77,31.21 31.77,19.71 24.38,12.32 22.73,12.32 22.29,12.76 U7.2
D7/!CTS!  (via drill 0.3)
  Top 0.254: J2.12 27.28,22.07 25.53,20.32 J5.9 | U7.9 17.91,13.79 v17.91,14.99
  Bottom 0.254: v17.91,14.99 17.91,16.13 18.87,17.09 21.87,17.09 22.23,17.45 22.23,19.18 23.36,20.32 J5.9
D8/!DTR!  (via drill 0.3)
  Top 0.254: J6.9 10.41,20.32 9.83,20.9 9.83,23.44 8.95,24.32 J2.9 | U7.1 22.92,19.37 v21.97,20.32
  Route2 0.254: v21.97,20.32 J6.9
D9/!SLEEP!
  Top 0.254: J5.8 25.72,24.45 25.72,25.46 26.57,26.32 J2.13
D10/RSSI_PWM  (via drill 0.3)
  Top 0.254: J2.6 8.28,29.69 8.89,29.08 10.29,29.08 J6.6 | R2.1 16.3,6.82 14.22,8.89 v13.97,8.89 | v3.68,26.67 3.68,9.02 v3.81,8.89
  Route2 0.254: v3.68,26.67 3.68,26.92 3.94,27.18 8.64,27.18 9.4,27.94 J6.6
  Bottom 0.254: v13.97,8.89 v3.81,8.89
D11/SDA  (via drill 0.3)
  Top 0.254: J2.7 8.51,28.32 J6.7 | v27.08,12.09 27.13,12.04 R14.1 27.99,9 27.99,6.91 27.17,6.09 J4.3
  Bottom 0.254: v27.08,12.09 26.7,12.09 25.2,13.59 14.35,13.59 13.97,13.97 13.97,15.82 13.21,16.59 9.92,16.59 9.4,17.11 9.4,23.37 J6.7
D12/SPI_POCI
  Top 0.254: J2.4 10.13,34.32 J6.4
D13/TXO  (via drill 0.3)
  Top 0.254: J6.2 11.21,38.32 J2.2 8.25,38.35 v6.99,38.35 | U7.4 21.02,13.02 20.32,12.32 14.99,12.32 13.34,13.97 10.41,13.97 6.99,17.4 v6.99,23.37
  Bottom 0.254: v6.99,23.37 v6.99,38.35
D14/RXI  (via drill 0.3)
  Top 0.254: J6.3 8.63,35.56 7.87,36.32 J2.3 5.28,34.78 v5.33,34.72 | U7.20 22.92,10.1 21.46,11.56 14.32,11.56 12.67,13.21 9.62,13.21 5.33,17.5 v5.33,22.86
  Bottom 0.254: v5.33,22.86 v5.33,34.72
D+
  Top 0.203: U7.11 17.21,9.44 16.71,9.93 13.13,9.93 12.32,9.12 12.32,9.02 12.32,8.85 | 12.32,8.85 U5.6 | J3.A6 9.91,6.74 10.16,6.99 10.67,6.99 10.85,6.81 | J3.B6 10.91,6.74 10.85,6.81 | 10.85,6.81 12.32,8.28 12.32,8.85
D-
  Top 0.203: J3.A7 10.41,5.38 10.11,5.08 9.75,5.08 9.41,5.42 J3.B7 9.41,7.25 10.48,8.32 U5.4 10.48,9.21 11.56,10.29 16.87,10.29 17.84,9.31 U7.12
EN  (via drill 0.3)
  Top 0.254: U2.2 16.51,18.12 R3.1 15.75,17.18 15.75,14.38 v15.88,14.25
  Bottom 0.254: J8.1 23.11,14.22 15.88,14.22 v15.88,14.25
GND  (via drill 0.3)
  Top 0.254: U7.6 19.75,15.24 C14.2 | U7.16 20.38,7.9 20.71,7.57 C11.2
  other vias: 20.57,24.64 22.1,24.64 18.29,21.59 20.57,23.37 22.1,23.37 0.64,40.26 0.64,38.73 0.64,37.21 0.64,35.69 0.64,34.16 0.64,32.64 33.53,30.23 29.46,29.21 22.1,21.59 16.89,14.99 13.84,8.13 4.37,9.58 5.21,12.95 30.73,12.83 30.73,7.24 25.2,3.73 6.99,39.24 5.97,34.42 6.22,22.86 2.92,26.42 11.46,12.65 6.99,12.57 9.53,11.18 17.78,40.64 34.29,40.64 26.67,1.27 1.27,6.35 13.26,25.55 13.21,29.06 8.31,21.11 13.06,21.08 20.52,9.6 18.77,15.14 13.39,7.06 20.8,0.66 18.26,0.64 15.27,3.96 33.53,10.03 5.97,30.61 29.21,39.37 29.21,36.83 29.21,31.75 29.21,25.4 29.21,19.05 6.35,19.05 2.54,19.05 4.45,39.24 33.4,36.83 23.47,12.93 22.86,36.83 22.86,34.29 22.86,31.75 17.78,31.75 17.78,34.29 12.7,34.29 12.7,36.83 12.7,39.37 22.86,39.37 1.27,30.48 34.92,25.15 34.92,18.8 34.92,34.04 21.59,12.32 6.6,7.11 26.11,11.51 22.17,9.6 20.52,4.34 16.31,8.48 23.37,5.66 27.89,11.51
  pour Bottom (isolate 0.127, rank 3): 0,0 35.56,0 35.56,41.66 0,41.66
  pour Route2 (isolate 0.127, rank 3): 0,0 35.56,0 35.56,41.66 0,41.66
  pour Top (rank 3): 0,41.66 35.56,41.66 35.56,0 0,0
N$1
  Top 0.254: U2.6 14.8,21.7 14.1,22.39 C3.1
N$2
  Top 0.254: R2.2 17.02,5.04 17.09,4.97 D4.A
N$3  (via drill 0.3)
  Top 0.254: D4.C v17.09,0.64
  Bottom 0.254: v17.09,0.64 D4.C RLED.2
N$5  (via drill 0.3)
  Top 0.254: J3.B5 11.91,6.96 v12.09,7.14 | v8.79,8.23 8.51,8.51 R8.2
  Bottom 0.254: v12.09,7.14 11,8.23 v8.79,8.23
N$6
  Top 0.254: J3.A5 8.91,7.04 8.03,7.92 7.29,7.92 6.99,8.23 R7.2
N$7
  Top 0.254: D2.A 20.84,3.31 21.03,3.5 21.03,3.8 R11.2
N$8
  pour Top (isolate 0.305, no thermals): 16.89,21.08 16.89,23.11 19.3,23.11 19.3,24.89 12.95,24.89 12.95,23.11 16.13,23.11 16.13,21.08
N$11  (via drill 0.3)
  Top 0.254: v26.57,6.53 26.72,6.68 26.74,6.68 27.13,7.07 R14.2
  Bottom 0.254: v26.57,6.53 26.42,6.68 26.3,6.68 25.83,7.14 I2C_PU.3
N$12
  Top 0.254: D3.A 22.05,3.37 25.43,6.74 R12.2
N$13  (via drill 0.3)
  Top 0.254: v28.78,7.19 28.83,7.24 R15.2
  Bottom 0.254: I2C_PU.1 28.47,8.33 28.47,7.49 v28.78,7.19
N$21  (via drill 0.3)
  Top 0.254: D3.C v22.05,0.64
  Bottom 0.254: ALED.2 D3.C v22.05,0.64
N$23  (via drill 0.3)
  Top 0.254: v19.51,0.64 D2.C
  Bottom 0.254: v19.51,0.64 PLED.2
SHLD  (via drill 0.3)
  other vias: 7.62,1.27 12.7,1.27
  pour Top (rank 2, no thermals): 5.84,0.25 5.84,6.1 14.48,6.1 14.48,0.25
  pour Bottom (rank 2, no thermals): 5.84,0.25 5.84,6.1 14.48,6.1 14.48,0.25
  pour Route15 (rank 2, no thermals): 5.84,0.25 5.84,6.1 14.48,6.1 14.48,0.25
  pour Route2 (rank 2, no thermals): 5.84,0.25 5.84,6.1 14.48,6.1 14.48,0.25
VIN  (via drill 0.3)
  Top 0.254: U5.5 11.43,8.38 v10.67,7.62
  Route15 0.254: v10.67,7.62 7.75,7.62
  Route15 0.762: v7.75,6.99 7.75,7.62 7.75,11.56 J1.1 14.22,18.03 v18.41,18.03 v18.97,18.59
  pour Top (no thermals): 16.89,16.76 16.89,17.91 17.27,18.29 17.27,19.56 21.59,19.56 21.59,17.5 21.49,17.4 18.54,17.4 17.91,16.76
  pour Top (no thermals): 7.49,7.24 7.49,4.95 8.64,3.81 11.68,3.81 12.83,4.95 12.83,6.48 12.45,6.48 12.45,5.71 12.32,5.59 8,5.59 8,7.24

### Text on the board
Top: 1
Route2: 2
Route15: 3
Bottom: 4 | v10
Measures: Units in Inches
tDocu: Four Layer Board | 1.6mm Thickness | Lead Free HASL | Elias Santistevan